# EAGLE design untitled (EAGLE 7.1.0)
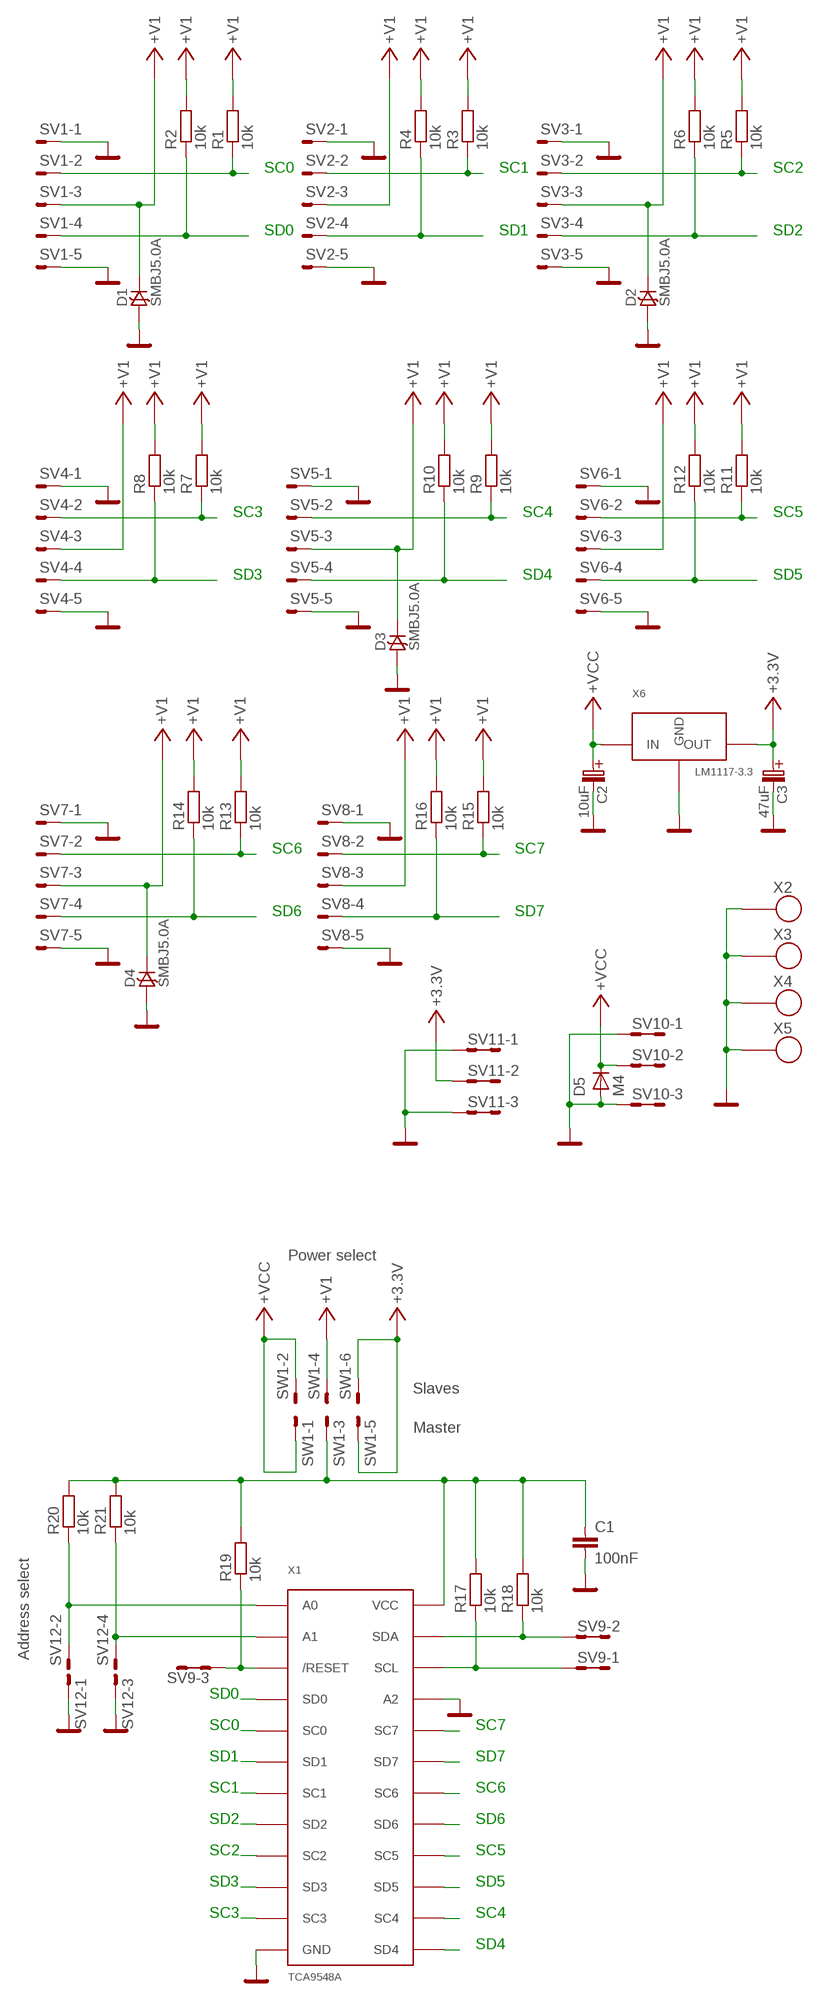
[diagram p0: schematic, sheet 1]

## Parts
C1  100nF  C0805  [C0805]
C2  10uF  B  [B]
C3  47uF  C  [C]
D1  SMBJ5.0A  D-TRANSIL-SMA  [SMA]
D2  SMBJ5.0A  D-TRANSIL-SMA  [SMA]
D3  SMBJ5.0A  D-TRANSIL-SMA  [SMA]
D4  SMBJ5.0A  D-TRANSIL-SMA  [SMA]
D5  M4  D-OB.SMA  [SMA]
R1  10k  R0805  [0805]
R2  10k  R0805  [0805]
R3  10k  R0805  [0805]
R4  10k  R0805  [0805]
R5  10k  R0805  [0805]
R6  10k  R0805  [0805]
R7  10k  R0805  [0805]
R8  10k  R0805  [0805]
R9  10k  R0805  [0805]
R10  10k  R0805  [0805]
R11  10k  R0805  [0805]
R12  10k  R0805  [0805]
R13  10k  R0805  [0805]
R14  10k  R0805  [0805]
R15  10k  R0805  [0805]
R16  10k  R0805  [0805]
R17  10k  R0805  [0805]
R18  10k  R0805  [0805]
R19  10k  R0805  [0805]
R20  10k  R0805  [0805]
R21  10k  R0805  [0805]
SV1  MA05-1  [MA05-1]
SV2  MA05-1  [MA05-1]
SV3  MA05-1  [MA05-1]
SV4  MA05-1  [MA05-1]
SV5  MA05-1  [MA05-1]
SV6  MA05-1  [MA05-1]
SV7  MA05-1  [MA05-1]
SV8  MA05-1  [MA05-1]
SV9  MA03-2  [MA03-2]
SV10  MA03-2  [MA03-2]
SV11  MA03-2  [MA03-2]
SV12  MA02-3  [MA02-2]
SW1  MA03-3  [MA03-2]
X1  TCA9548A  [TSS0P24]
X2  SROUB3M  [SROUB3M]
X3  SROUB3M  [SROUB3M]
X4  SROUB3M  [SROUB3M]
X5  SROUB3M  [SROUB3M]
X6  LM1117-3.3  LM1117  [SOT223]

## Nets
+3.3V: C3.+(C_EL+) SV11.3 SV11.4 SW1.5 SW1.6 X6.2(OUT) X6.4(OUT)
+V1: D1.K D2.K D3.K D4.K R1.2 R2.2 R3.2 R4.2 R5.2 R6.2 R7.2 R8.2 R9.2 R10.2 R11.2 R12.2 R13.2 R14.2 R15.2 R16.2 SV1.3 SV2.3 SV3.3 SV4.3 SV5.3 SV6.3 SV7.3 SV8.3 SW1.4
+VCC: C2.+(C_EL+) D5.K(C) SV10.3 SV10.4 SW1.1 SW1.2 X6.3(IN)
/RESET: R19.1 SV9.5 SV9.6 X1.3(/RESET)
A0: R20.1 SV12.2 X1.1(A0)
GND: C1.2 C2.-(C_EL-) C3.-(C_EL-) D1.A D2.A D3.A D4.A D5.A SV1.1 SV1.5 SV2.1 SV2.5 SV3.1 SV3.5 SV4.1 SV4.5 SV5.1 SV5.5 SV6.1 SV6.5 SV7.1 SV7.5 SV8.1 SV8.5 SV10.1 SV10.2 SV10.5 SV10.6 SV11.1 SV11.2 SV11.5 SV11.6 SV12.1 SV12.3 X1.12(GND) X1.21(A2) X2.P$1 X3.P$1 X4.P$1 X5.P$1 X6.1(GND)
N$2: R21.1 SV12.4 X1.2(A1)
N$5: C1.1 R17.2 R18.2 R19.2 R20.2 R21.2 SW1.3 X1.24(VCC)
SC0: R1.1 SV1.2 X1.5(SC0)
SC1: R3.1 SV2.2 X1.7(SC1)
SC2: R5.1 SV3.2 X1.9(SC2)
SC3: R7.1 SV4.2 X1.11(SC3)
SC4: R9.1 SV5.2 X1.14(SC4)
SC5: R11.1 SV6.2 X1.16(SC5)
SC6: R13.1 SV7.2 X1.18(SC6)
SC7: R15.1 SV8.2 X1.20(SC7)
SCL: R17.1 SV9.1 SV9.2 X1.22(SCL)
SD0: R2.1 SV1.4 X1.4(SD0)
SD1: R4.1 SV2.4 X1.6(SD1)
SD2: R6.1 SV3.4 X1.8(SD2)
SD3: R8.1 SV4.4 X1.10(SD3)
SD4: R10.1 SV5.4 X1.13(SD4)
SD5: R12.1 SV6.4 X1.15(SD5)
SD6: R14.1 SV7.4 X1.17(SD6)
SD7: R16.1 SV8.4 X1.19(SD7)
SDA: R18.1 SV9.3 SV9.4 X1.23(SDA)

## Notes on the sheet
- SC0 | SC1 | SC2
- SD0 | SD1 | SD2
- SC3 | SC4 | SC5
- SD3 | SD4 | SD5
- SC6 | SC7
- SD6 | SD7
- Power select
- Slaves
- Master
- Address select
- SD0
- SC0 | SC7
- SD1 | SD7
- SC1 | SC6
- SD2 | SD6
- SC2 | SC5
- SD3 | SD5
- SC3 | SC4
- SD4

## Library data of the parts
C1 = moje_C:C0805
C2 = moje_C:B
C3 = moje_C:C
D1-D4 = moje_diody:D-TRANSIL-SMA
D5 = moje:D-OB.SMA: SMA
R1-R21 = moje_R:R0805
SV1-SV8 = moje_hrebinky:MA05-1: PIN HEADER; OC_FARNELL: unknown; OC_NEWARK: unknown
SV9-SV11 = moje_hrebinky:MA03-2: PIN HEADER; OC_FARNELL: unknown; OC_NEWARK: unknown
SV12 = moje_hrebinky:MA02-3
SW1 = moje_hrebinky:MA03-3
X1 = moje_io:TCA9548A: I2C HUB TSSOP24
X2-X5 = moje:SROUB3M
X6 = moje_stabil:LM1117: STABILIZATOR LM1117

## Board
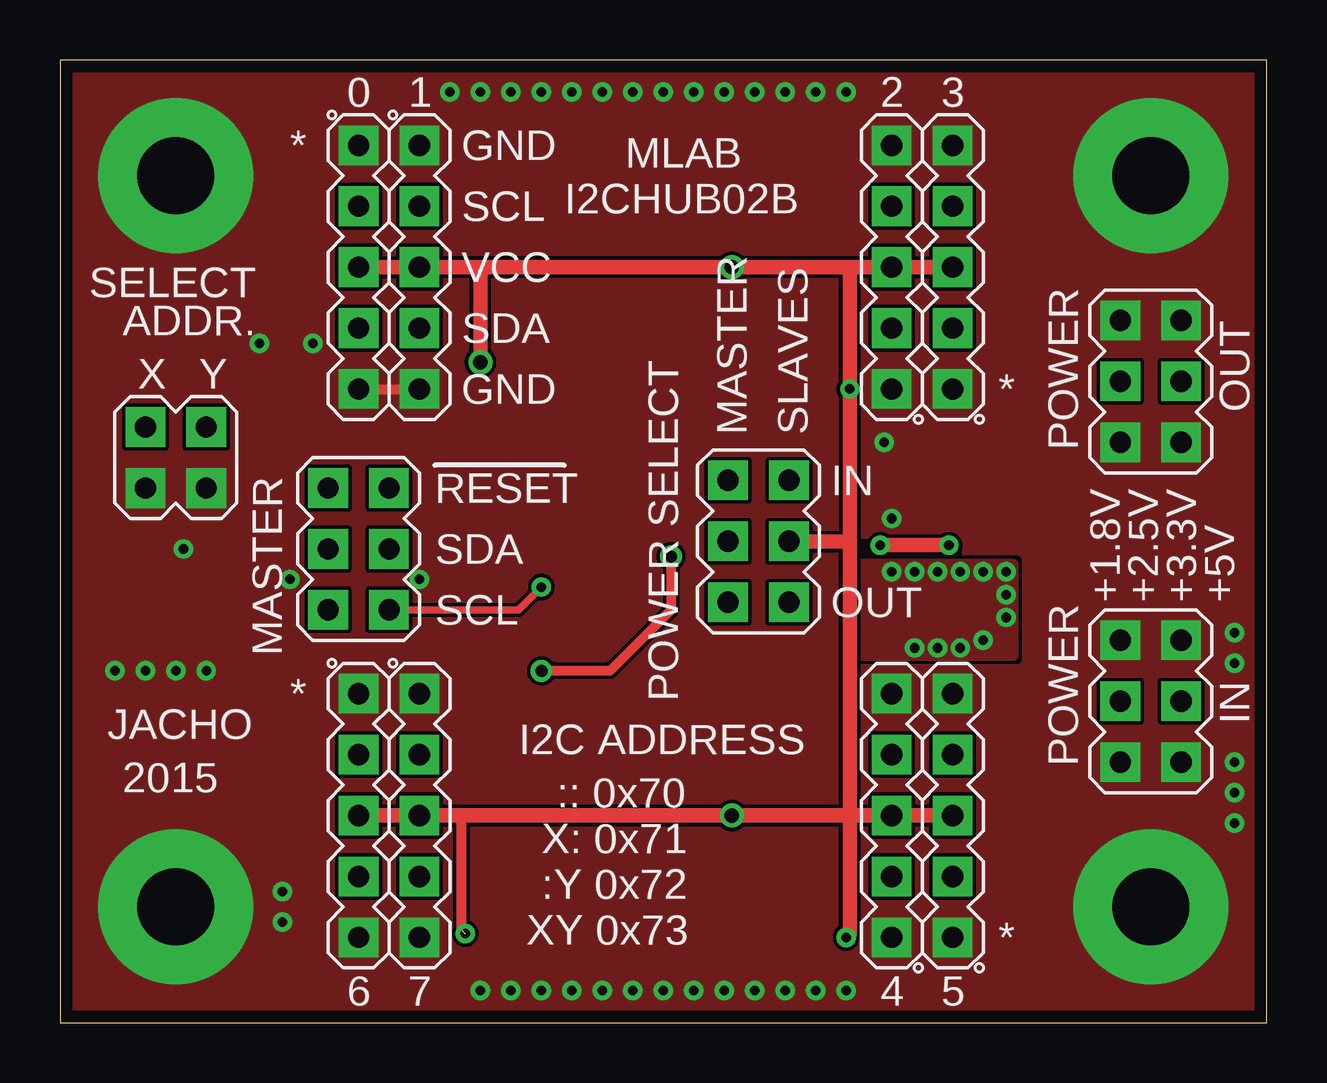
[diagram p1: board, top side]
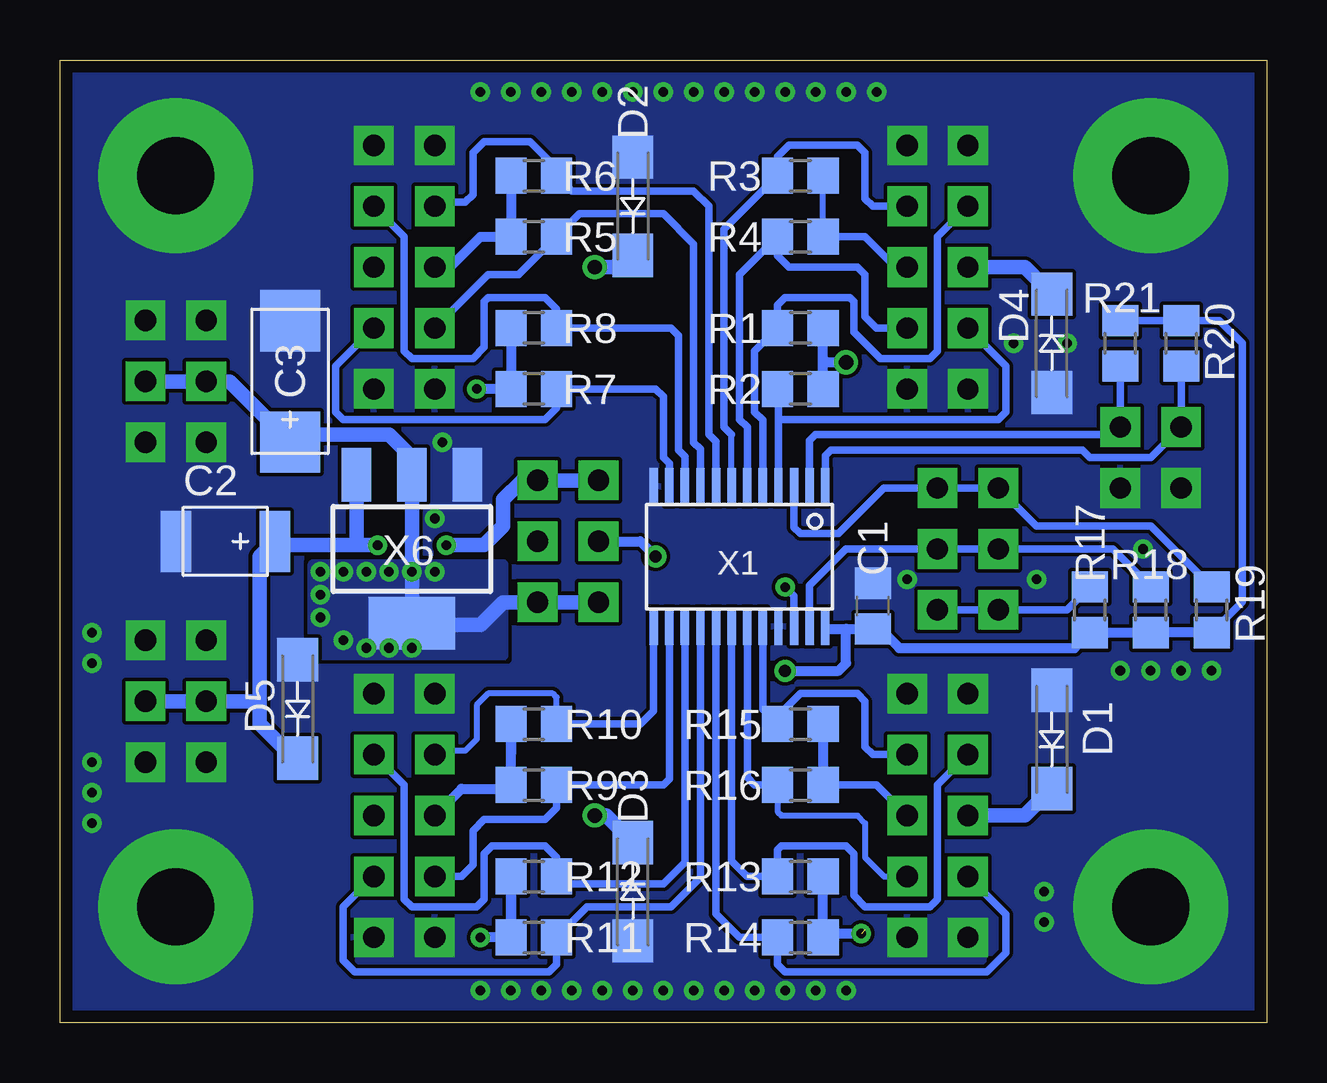
[diagram p2: board, bottom side, seen from below]

Size 50.29 x 40.13 mm. Coordinates in mm from the lower left corner, seen from the top.
Outline: 0,0 50.29,0 50.29,40.13 0,40.13 0,0
Copper layers (1*16): Top 0.035mm / dielectric 1.5mm / Bottom 0.035mm
Design rules "jacho": minimum track width 8mil, minimum drill 16mil, track to track 6mil, track to pad 6mil, pad to pad 6mil, via to via 6mil, smd to smd 6mil, copper to edge 20mil, drill to drill 8mil, minimum pad ring 10mil, minimum via ring 8mil, stop-mask expansion 4mil, vias tented up to drill 25mil, thermal gap 0mil

### Footprints (pad centres in the part's own frame; a part is rotated, then mirrored left to right if it is on the bottom)
C0805 = smd 1.3 x 1.5: 1 -0.95,0; 2 0.95,0
B = smd 1.27 x 2.54: + 2.223,0; - -1.905,0
C = smd 2.55 x 2.5: + 2.525,0; - -2.525,0
SMA = smd 1.8 x 1.7: A -2.05,0; K 2.05,0
0805 = smd 1.3 x 1.5: 1 -0.95,0; 2 0.95,0
MA05-1 = drill 0.889 pad 1.651 square: 1 -5.08,0; 2 -2.54,0; 3 0,0; 4 2.54,0; 5 5.08,0
MA03-2 = drill 0.889 pad 1.651 square: 1 -2.54,-1.27; 2 -2.54,1.27; 3 0,-1.27; 4 0,1.27; 5 2.54,-1.27; 6 2.54,1.27
MA02-2 = drill 0.889 pad 1.651 square: 1 -1.27,-1.27; 2 -1.27,1.27; 3 1.27,-1.27; 4 1.27,1.27
TSS0P24 = smd 0.35 x 1.55: 1 -3.575,-2.918; 2 -2.925,-2.918; 3 -2.275,-2.918; 4 -1.625,-2.918; 5 -0.975,-2.918; 6 -0.325,-2.918; 7 0.325,-2.918; 8 0.975,-2.918; 9 1.625,-2.918; 10 2.275,-2.918; 11 2.925,-2.918; 12 3.575,-2.918; 13 3.575,2.918; 14 2.925,2.918; 15 2.275,2.918; 16 1.625,2.918; 17 0.975,2.918; 18 0.325,2.918; 19 -0.325,2.918; 20 -0.975,2.918; 21 -1.625,2.918; 22 -2.275,2.918; 23 -2.925,2.918; 24 -3.575,2.918
SROUB3M = drill 3.2 pad 6.452: P$1 0,0
SOT223 = smd 1.219 x 2.235: 1 -2.311,-3.099; 2 0,-3.099; 3 2.311,-3.099 | smd 3.6 x 2.2: 4 0,3.099

### Placement (x,y rotation side)
C1  16.41,17.37 90 bottom
C2  43.56,20.07 0 bottom
C3  40.7,26.73 270 bottom
D1  8.95,11.81 270 bottom
D2  26.42,34.04 270 bottom
D3  26.42,5.46 90 bottom
D4  8.95,28.32 90 bottom
D5  40.39,13.08 270 bottom
R1  19.43,28.96 0 bottom
R2  19.43,26.42 0 bottom
R3  19.43,35.31 0 bottom
R4  19.43,32.77 0 bottom
R5  30.54,32.77 180 bottom
R6  30.54,35.31 180 bottom
R7  30.54,26.42 180 bottom
R8  30.54,28.96 180 bottom
R9  30.54,9.91 180 bottom
R10  30.54,12.45 180 bottom
R11  30.54,3.56 180 bottom
R12  30.54,6.1 180 bottom
R13  19.43,6.1 0 bottom
R14  19.43,3.56 0 bottom
R15  19.43,12.45 0 bottom
R16  19.43,9.91 0 bottom
R17  7.37,17.21 270 bottom
R18  4.83,17.21 270 bottom
R19  2.29,17.21 270 bottom
R20  3.56,28.32 90 bottom
R21  6.1,28.32 90 bottom
SV1  12.45,31.5 270 top
SV2  14.99,31.5 270 top
SV3  34.67,31.5 90 top
SV4  37.21,31.5 90 top
SV5  34.67,8.64 90 top
SV6  37.21,8.64 90 top
SV7  12.45,8.64 270 top
SV8  14.99,8.64 270 top
SV9  12.45,19.75 90 top
SV10  45.47,13.4 270 top
SV11  45.47,26.73 270 top
SV12  4.83,23.56 0 top
SW1  29.11,20.07 270 top
X1  21.97,19.43 180 bottom
X2  4.83,4.83 0 top
X3  4.83,35.31 0 top
X4  45.47,4.83 0 top
X5  45.47,35.31 0 top
X6  35.62,19.75 180 bottom

### Tracks (layer width: path | path; a pad name or v marks a point on that pad's centre or on a via)
+3.3V  (via drill 0.4)
  Bottom 0.61: SW1.5 SW1.6 31.81,17.53 32.77,16.57 35.55,16.57 X6.4 X6.2 35.62,23.56 36.58,24.51 40.7,24.51 C3.+ | SV11.4 SV11.3 43.23,26.73 C3.+ | C3.+ 40.7,24.19
  other vias: 38.48,15.94 39.43,16.89 39.43,17.84 39.43,18.8 38.48,18.8 37.53,18.8 36.58,18.8 35.62,18.8 34.67,18.8 37.53,15.62 35.62,15.62 36.58,15.62
  pour Bottom: 31.81,19.11 31.81,15.3 39.75,15.3 39.75,19.11
  pour Top: 31.81,19.11 31.81,15.3 39.75,15.3 39.75,19.11
+V1  (via drill 0.4, 0.6)  (1 unrouted)
  Top 0.406: 16.1,31.5 SV2.3 | SV6.3 37.37,8.64 | 32.93,31.34 32.77,31.5 | 16.73,3.87 16.73,8.48 16.89,8.64
  Top 0.61: SV1.3 SV2.3 17.53,31.5 | v17.53,27.53 17.53,31.5 | SV4.3 SV3.3 32.77,31.5 v28,31.5 17.53,31.5 | 32.93,31.34 v32.93,26.42 32.93,20.07 | SW1.4 32.93,20.07 | 32.93,8.64 v28,8.64 16.89,8.64 SV8.3 SV7.3 | 32.93,8.64 SV5.3 SV6.3 | v32.77,3.56 32.93,3.71 32.93,8.64 | 32.93,8.64 32.93,20.07
  Bottom 0.254: R4.2 18.48,34.99 18.64,35.15
  Bottom 0.305: SV2.3 15.46,31.5 16.73,32.77 R4.2 | R16.2 16.26,9.91 SV8.3 | 26.42,7.37 D3.K 26.42,7.68
  Bottom 0.406: R2.2 18.48,27.69 | 18.48,27.69 R1.2 | R15.2 R16.2 | 15.14,8.79 SV8.3 | R13.2 R14.2 18.32,3.71 v16.89,3.71 | R11.2 R12.2 R11.2 v32.77,3.56 | 18.64,35.15 R3.2 | R6.2 R5.2 32.77,32.77 34.04,31.5 SV3.3 | R8.2 R7.2 v32.93,26.42 | 31.5,11.18 31.49,11.18 R10.2 R9.2 31.65,9.75 33.56,9.75 SV5.3 | v17.53,27.53 18.32,27.53 18.48,27.69
  Bottom 0.61: SV7.3 10.08,8.64 D1.K | v28,31.5 26.91,31.5 D2.K | v28,8.64 27.54,8.64 D3.K | SV1.3 10.08,31.5 D4.K
+VCC  (via drill 0.4)
  Top 0.61: v34.2,19.91 v37.05,19.91
  Bottom 0.61: X6.3 37.94,19.98 38.01,19.91 | SW1.1 SW1.2 31.02,22.61 31.81,21.81 31.81,20.7 32.61,19.91 v34.2,19.91 | v37.05,19.91 38.01,19.91 | 38.01,19.91 41.18,19.91 C2.+ 41.97,19.43 41.97,13.4 | SV10.4 SV10.3 41.97,13.4 | D5.K 40.56,11.03 41.97,12.45 41.97,13.4
/RESET
  Bottom 0.305: X1.3 19.7,20.65 19.43,20.38 17.84,20.38 15.94,22.29 SV9.5 SV9.6 9.59,20.7 4.83,20.7 R19.1 2.29,18.48
A0
  Bottom 0.305: X1.1 18.4,23.64 18.16,23.88 7.68,23.88 7.37,23.56 4.83,23.56 SV12.2 R20.1
GND  (via drill 0.4)
  Top 0.406: SV1.5 SV2.5
  other vias: 21.34,1.33 22.61,1.33 23.88,1.33 25.15,1.33 26.42,1.33 27.69,1.33 48.96,10.86 48.96,9.59 48.96,8.32 48.96,14.99 48.96,16.26 54.67,23.56 56.26,24.19 56.26,25.46 56.26,26.42 53.72,27.69 55.94,28.64 55.94,25.15 25.15,38.8 26.42,38.8 27.69,38.8 28.96,38.8 30.23,38.8 31.5,38.8 32.77,38.8 23.88,38.8 22.61,38.8 21.34,38.8 20.07,38.8 18.8,38.8 17.53,38.8 16.26,38.8 28.96,1.33 30.23,1.33 31.5,1.33 32.77,1.33 20.07,1.33 18.8,1.33 17.53,1.33 9.27,5.46 9.27,4.19 5.14,19.75 9.59,18.48 14.99,18.48 2.29,14.67 3.56,14.67 4.83,14.67 6.1,14.67 34.35,24.19 34.67,21.02 8.32,28.32 10.54,28.32
  pour Bottom (rank 2): 0.06,40.07 0.06,-0.25 50.23,-0.25 50.23,40.23 -0.1,40.23 -0.1,39.91
  pour Top (rank 2): 0.22,39.91 50.55,39.91 50.55,-1.37 0.06,-1.37 0.06,39.91
N$2
  Bottom 0.305: R21.1 SV12.4 6.41,24.51 18.8,24.51 19.05,24.26 X1.2
N$5  (via drill 0.5)
  Top 0.406: v25.46,19.43 25.46,17.21 22.92,14.67 v20.07,14.67
  Bottom 0.305: 18.3,16.41 X1.24 | R19.2 1.02,17.53 1.02,28.32 1.97,29.27 R20.2 R21.2
  Bottom 0.406: R19.2 R18.2 R17.2 7.68,16.58 7.68,15.94 8,15.62 15.3,15.62 16.1,16.41 C1.1 | SW1.3 26.1,20.07 v25.46,19.43 | v20.07,14.67 17.84,14.67 17.53,14.99 17.53,16.41 | 17.53,16.41 17.53,16.42 | 18.3,16.41 17.53,16.41 | 17.53,16.41 C1.1 | C1.1 | 17.53,16.41
SC0
  Bottom 0.305: SV1.2 13.72,32.77 13.72,28 14.03,27.69 16.1,27.69 17.21,28.8 17.21,30.07 17.37,30.23 20.07,30.23 20.38,29.91 R1.1 21.34,28 21.34,25.46 21,25.12 X1.5
SC1
  Bottom 0.254: R3.1 20.38,36.1 | X1.7 22.3,24.52
  Bottom 0.305: 20.38,36.1 19.91,36.58 17.05,36.58 16.73,36.26 16.73,34.35 16.41,34.04 SV2.2 | 22.3,24.52 22.61,24.83 22.61,33.08 R3.1
SC2
  Bottom 0.305: X1.9 23.6,23.91 23.88,24.19 23.88,32.45 25.15,33.72 28.64,33.72 R5.1 31.18,31.18 32.45,31.18 SV3.2
SC3
  Bottom 0.305: X1.11 24.9,23.31 25.15,23.56 25.15,26.1 25.46,26.42 R7.1 29.59,25.62 30.07,25.15 38.48,25.15 38.8,25.46 38.8,27.37 SV4.2
SC4
  Bottom 0.305: R9.1 29.59,8.95 30.07,8.48 32.61,8.48 33.08,8 33.08,6.57 33.56,6.1 SV5.2 | X1.14 24.9,10.16 25.15,9.91 R9.1
  Bottom 0.406: R9.1
SC5
  Bottom 0.305: X1.16 23.6,6.06 24.83,4.83 28.32,4.83 R11.1 29.59,2.44 29.91,2.13 38.01,2.13 38.48,2.6 38.48,4.83 SV6.2
SC6
  Bottom 0.305: SV7.2 13.72,9.91 13.72,5.14 14.03,4.83 16.73,4.83 17.21,5.3 17.21,7.05 17.53,7.37 20.22,7.37 20.38,7.21 R13.1 21.65,6.1 22.3,6.74 X1.18
SC7
  Bottom 0.305: 14.83,11.18 SV8.2 16.41,11.18 16.73,11.49 16.73,13.4 17.05,13.72 19.43,13.72 20.07,13.08 20.07,12.76 R15.1 21,13.06 X1.20
SCL  (via drill 0.4)
  Top 0.305: SV9.1 19.11,17.21 v20.07,18.16
  Bottom 0.305: X1.22 19.7,17.79 v20.07,18.16 | SV9.1 SV9.2 8.32,17.21 R17.1
SD0
  Bottom 0.254: 20.35,26.38 R2.1
  Bottom 0.305: X1.4 20.35,25.15 | 20.35,25.15 20.35,26.38 | 20.35,25.15 11.18,25.15 10.86,25.46 10.86,27.37 SV1.4
SD1
  Bottom 0.305: SV2.4 16.26,28.96 16.73,29.43 16.73,31.18 17.05,31.5 19.91,31.5 20.38,31.97 R4.1 21.97,31.18 21.97,25.15 21.65,24.82 X1.6
SD2
  Bottom 0.254: 34.51,34.2 SV3.4 | 29.59,35.62 R6.1
  Bottom 0.305: 34.51,34.2 33.4,34.2 33.08,34.51 33.08,36.26 32.61,36.73 30.7,36.73 29.59,35.62 | X1.8 22.95,24.22 23.24,24.51 23.24,34.04 23.88,34.67 28.96,34.67 R6.1
SD3
  Bottom 0.305: SV4.4 35.94,32.77 35.94,28 35.62,27.69 33.08,27.69 32.61,28.16 32.61,30.07 32.45,30.23 30.07,30.23 29.59,29.75 R8.1 24.83,28.96 24.51,28.64 24.51,23.88 24.25,23.61 X1.10
SD4
  Bottom 0.254: R10.1 29.59,13.56 29.75,13.72 32.45,13.72 32.93,13.24 32.93,11.81 33.4,11.34 34.51,11.34
  Bottom 0.305: 34.51,11.34 SV5.4 | X1.13 25.55,13 26.1,12.45 R10.1
SD5
  Bottom 0.305: SV6.4 35.94,9.91 35.94,5.14 35.62,4.83 32.93,4.83 32.61,5.14 32.61,7.05 32.29,7.37 30.07,7.37 29.59,6.89 R12.1 29.28,5.78 25.15,5.78 24.25,6.68 X1.15
SD6
  Bottom 0.305: X1.17 22.95,4.53 21.97,3.56 R14.1 20.38,2.44 20.07,2.13 11.65,2.13 10.86,2.92 10.86,4.51 SV7.4
SD7
  Bottom 0.254: R16.1 20.38,8.79 20.22,8.64 17.05,8.64 16.73,8.32 16.73,6.89 15.94,6.1 SV8.4
  Bottom 0.305: X1.19 21.65,10.22 21.34,9.91 R16.1
SDA
  Bottom 0.305: X1.23 19.05,18.23 17.53,19.75 SV9.3 SV9.4 6.42,19.75 R18.1

### Text on the board
tPlace: 0 | 1 | 2 | 3 | * | GND | MLAB | SCL | I2CHUB02B | VCC | SELECT | ADDR. | SDA | X | Y | GND | * | OUT | MASTER | SLAVES | POWER | RESET | IN | SDA | +1.8V | +2.5V | +3.3V | +5V | SCL | OUT | MASTER | POWER SELECT | * | IN | JACHO | I2C ADDRESS | POWER | 2015 | :: 0x70 | X: 0x71 | :Y 0x72 | XY 0x73 | * | 6 | 7 | 4 | 5